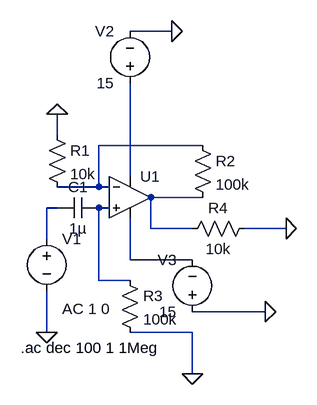
[diagram p0: schematic opamp_audio_preamp.asc]
opamp_audio_preamp.asc, the LTspice schematic file:
Version 4.1
SHEET 1 880 680
WIRE 368 -176 304 -176
WIRE 192 -16 192 -48
WIRE 416 0 256 0
WIRE 304 48 304 -96
WIRE 256 64 256 0
WIRE 256 64 192 64
WIRE 272 64 256 64
WIRE 416 80 336 80
WIRE 192 96 176 96
WIRE 272 96 256 96
WIRE 336 128 336 80
WIRE 400 128 336 128
WIRE 544 128 480 128
WIRE 176 144 176 96
WIRE 304 176 304 112
WIRE 400 176 304 176
WIRE 256 208 256 96
WIRE 304 208 256 208
WIRE 512 256 400 256
WIRE 176 288 176 224
WIRE 400 288 304 288
WIRE 400 352 400 288
FLAG 176 288 0
FLAG 192 -48 0
FLAG 368 -176 0
FLAG 512 256 0
FLAG 400 352 0
FLAG 544 128 0
SYMBOL voltage 176 128 R0
WINDOW 123 24 124 Left 2
WINDOW 39 0 0 Left 0
SYMATTR InstName V1
SYMATTR Value ""
SYMATTR Value2 AC 1 0
SYMBOL OpAmps\\UniversalOpAmp 304 80 R0
SYMATTR InstName U1
SYMBOL res 176 -32 R0
SYMATTR InstName R1
SYMATTR Value 10k
SYMBOL voltage 304 -80 R180
WINDOW 0 24 96 Left 2
WINDOW 3 24 16 Left 2
WINDOW 123 0 0 Left 0
WINDOW 39 0 0 Left 0
SYMATTR InstName V2
SYMATTR Value 15
SYMBOL voltage 400 272 R180
WINDOW 0 24 96 Left 2
WINDOW 3 24 16 Left 2
WINDOW 123 0 0 Left 0
WINDOW 39 0 0 Left 0
SYMATTR InstName V3
SYMATTR Value 15
SYMBOL res 400 -16 R0
SYMATTR InstName R2
SYMATTR Value 100k
SYMBOL cap 256 80 R90
WINDOW 0 0 32 VBottom 2
WINDOW 3 32 32 VTop 2
SYMATTR InstName C1
SYMATTR Value 1µ
SYMBOL res 288 192 R0
SYMATTR InstName R3
SYMATTR Value 100k
SYMBOL res 496 112 R90
WINDOW 0 0 56 VBottom 2
WINDOW 3 32 56 VTop 2
SYMATTR InstName R4
SYMATTR Value 10k
TEXT 136 312 Left 2 !.ac dec 100 1 1Meg

The netlist it stands for:
* opamp_audio_preamp.asc
V1 N004 0 AC 1 0
X§U1 N005 N001 N002 N006 N003 level1 Avol=1Meg GBW=10Meg Vos=0 En=0 Enk=0 In=0 Ink=0 Rin=500Meg  ; pins In+ In- V+ V- OUT
R1 0 N001 10k
V2 N002 0 15
V3 0 N006 15
R2 N001 N003 100k
C1 N005 N004 1µ
R3 N005 0 100k
R4 0 N003 10k
.ac dec 100 1 1Meg
.lib UniversalOpAmp1.lib
.backanno
.end